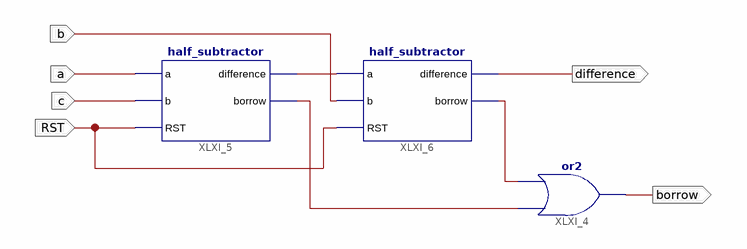
[diagram p0: schematic sheet 1]
// Xilinx ISE schematic full_subtractor.sch (artix7) as structural Verilog: 3 symbols, 6 ports
module full_subtractor (
  input  c,
  input  a,
  input  RST,
  input  b,
  output difference,
  output borrow
);

  wire XLXN_30, XLXN_31, XLXN_33;

  or XLXI_4 (borrow, XLXN_31, XLXN_30);
  half_subtractor XLXI_5 (.a(a), .b(c), .RST(RST), .difference(XLXN_33), .borrow(XLXN_31));
  half_subtractor XLXI_6 (.a(XLXN_33), .b(b), .RST(RST), .difference(difference), .borrow(XLXN_30));
endmodule
